# Altium schematic sheet MCU_GPIO.SchDoc
size A4; Organization: Altium Limited; Address1: L3, 12a Rodborough Rd; Address2: Frenchs Forest; Address3: NSW; Address4: Australia 2086; SheetNumber: 6; SheetTotal: 7
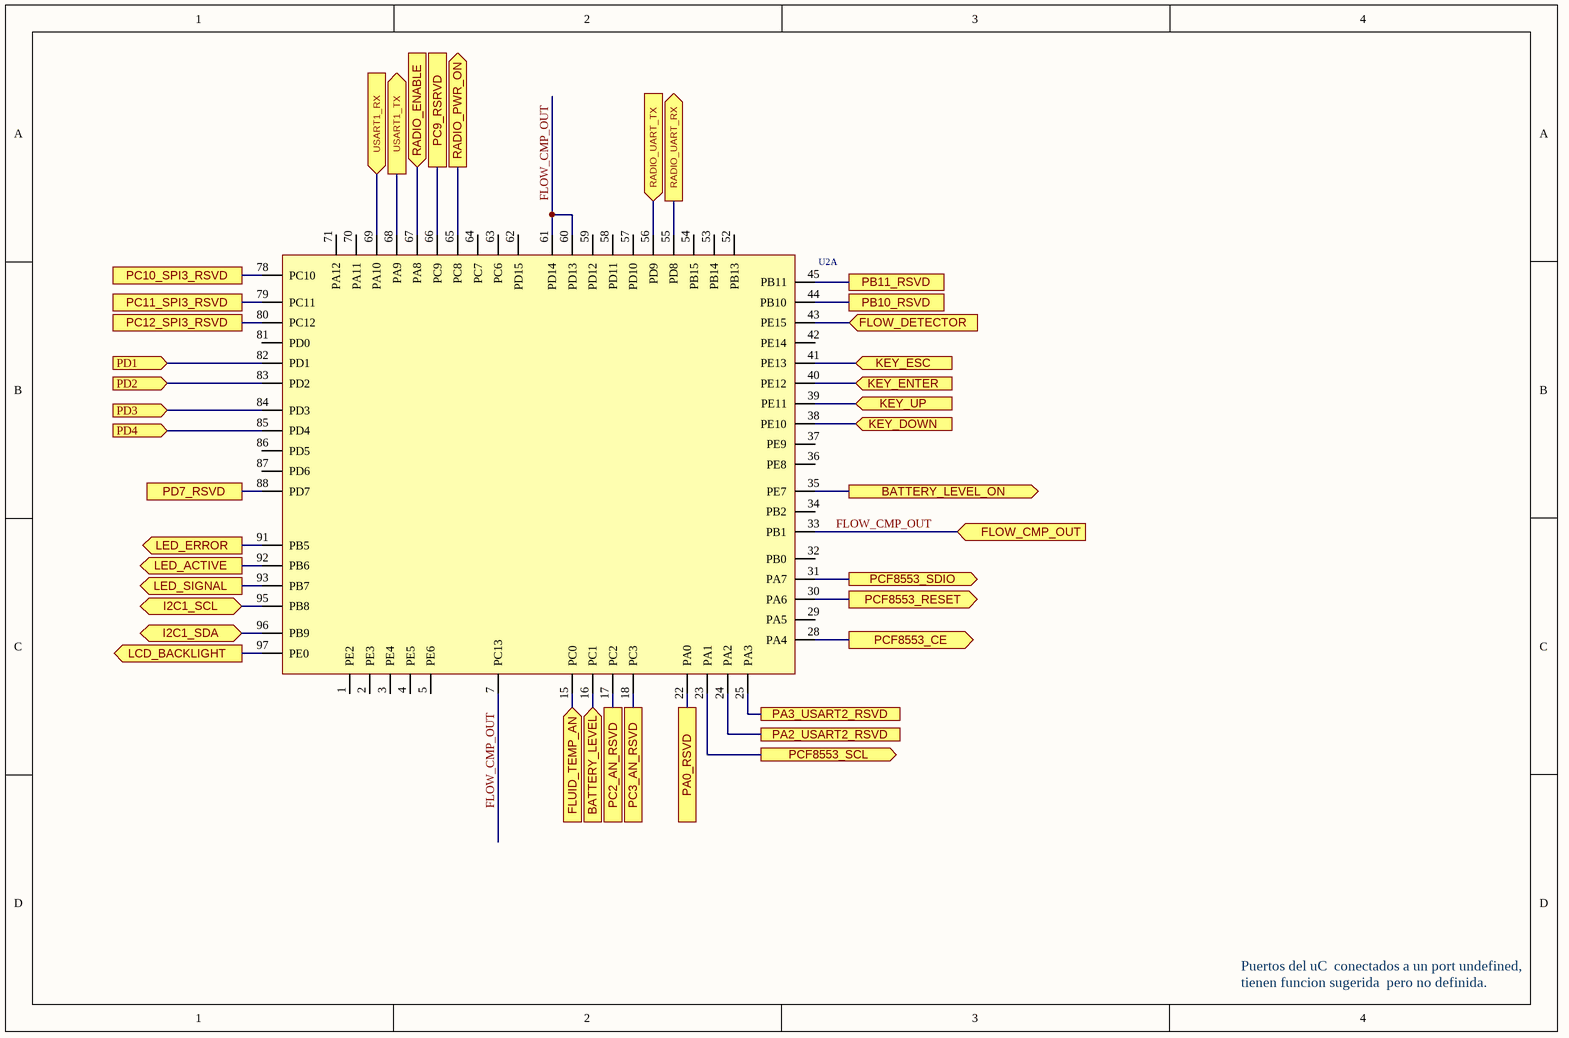
[diagram p0: MCU_GPIO.SchDoc]

## Parts
U2  STM32U575VIT6Q  [STM32U575VI]  (value not drawn)  (part A of 3)

## Ports
BATTERY_LEVEL (in), BATTERY_LEVEL_ON (out), FLOW_CMP_OUT (in), FLOW_DETECTOR (in), FLUID_TEMP_AN (in), I2C1_SCL (bidir), I2C1_SDA (bidir), KEY_DOWN (in), KEY_ENTER (in), KEY_ESC (in), KEY_UP (in), LCD_BACKLIGHT (out), LED_ACTIVE (out), LED_ERROR (out), LED_SIGNAL (out), PA0_RSVD, PA2_USART2_RSVD, PA3_USART2_RSVD, PB10_RSVD, PB11_RSVD, PC2_AN_RSVD, PC3_AN_RSVD, PC9_RSRVD, PC10_SPI3_RSVD, PC11_SPI3_RSVD, PC12_SPI3_RSVD, PCF8553_CE (out), PCF8553_RESET (out), PCF8553_SCL (out), PCF8553_SDIO (out), PD1 (in), PD2 (in), PD3 (in), PD4 (in), PD7_RSVD, RADIO_ENABLE (in), RADIO_PWR_ON (out), RADIO_UART_RX (out), RADIO_UART_TX (in), USART1_RX (in), USART1_TX (out)

## Nets
BATTERY_LEVEL: U2.16(PC1) ; port BATTERY_LEVEL
BATTERY_LEVEL_ON: U2.35(PE7) ; port BATTERY_LEVEL_ON
FLOW_CMP_OUT: U2.7(PC13) U2.33(PB1) U2.60(PD13) U2.61(PD14) ; port FLOW_CMP_OUT
FLOW_DETECTOR: U2.43(PE15) ; port FLOW_DETECTOR
FLUID_TEMP_AN: U2.15(PC0) ; port FLUID_TEMP_AN
I2C1_SCL: U2.95(PB8) ; port I2C1_SCL
I2C1_SDA: U2.96(PB9) ; port I2C1_SDA
KEY_DOWN: U2.38(PE10) ; port KEY_DOWN
KEY_ENTER: U2.40(PE12) ; port KEY_ENTER
KEY_ESC: U2.41(PE13) ; port KEY_ESC
KEY_UP: U2.39(PE11) ; port KEY_UP
LCD_BACKLIGHT: U2.97(PE0) ; port LCD_BACKLIGHT
LED_ACTIVE: U2.92(PB6) ; port LED_ACTIVE
LED_ERROR: U2.91(PB5) ; port LED_ERROR
LED_SIGNAL: U2.93(PB7) ; port LED_SIGNAL
PA0_RSVD: U2.22(PA0) ; port PA0_RSVD
PA2_USART2_RSVD: U2.24(PA2) ; port PA2_USART2_RSVD
PA3_USART2_RSVD: U2.25(PA3) ; port PA3_USART2_RSVD
PB10_RSVD: U2.44(PB10) ; port PB10_RSVD
PB11_RSVD: U2.45(PB11) ; port PB11_RSVD
PC2_AN_RSVD: U2.17(PC2) ; port PC2_AN_RSVD
PC3_AN_RSVD: U2.18(PC3) ; port PC3_AN_RSVD
PC9_RSRVD: U2.66(PC9) ; port PC9_RSRVD
PC10_SPI3_RSVD: U2.78(PC10) ; port PC10_SPI3_RSVD
PC11_SPI3_RSVD: U2.79(PC11) ; port PC11_SPI3_RSVD
PC12_SPI3_RSVD: U2.80(PC12) ; port PC12_SPI3_RSVD
PCF8553_CE: U2.28(PA4) ; port PCF8553_CE
PCF8553_RESET: U2.30(PA6) ; port PCF8553_RESET
PCF8553_SCL: U2.23(PA1) ; port PCF8553_SCL
PCF8553_SDIO: U2.31(PA7) ; port PCF8553_SDIO
PD1: U2.82(PD1) ; port PD1
PD2: U2.83(PD2) ; port PD2
PD3: U2.84(PD3) ; port PD3
PD4: U2.85(PD4) ; port PD4
PD7_RSVD: U2.88(PD7) ; port PD7_RSVD
RADIO_ENABLE: U2.67(PA8) ; port RADIO_ENABLE
RADIO_PWR_ON: U2.65(PC8) ; port RADIO_PWR_ON
RADIO_UART_RX: U2.55(PD8) ; port RADIO_UART_RX
RADIO_UART_TX: U2.56(PD9) ; port RADIO_UART_TX
USART1_RX: U2.69(PA10) ; port USART1_RX
USART1_TX: U2.68(PA9) ; port USART1_TX

Not connected (* = marked no-connect by the designer): U2 1(PE2) 2(PE3) 3(PE4) 4(PE5) 5(PE6) 29(PA5) 32(PB0) 34(PB2) 36(PE8) 37(PE9) 42(PE14) 52(PB13) 53(PB14) 54(PB15) 57(PD10) 58(PD11) 59(PD12) 62(PD15) 63(PC6) 64(PC7) 70(PA11) 71(PA12) 81(PD0) 86(PD5) 87(PD6)

## Notes on the sheet
- Puertos del uC  conectados a un port undefined, tienen funcion sugerida  pero no definida.
- Title:
- Size: A4
- Date:
- FMC-320U MODEL A
- Sheet:
- Time:
- Of:
- Version:
- Revision:
- Release:
- 1
- 0
- FLOWMEET SRL
- File

## Library data of the parts
U2 = STM32U575VIT6Q: Manufacturer: ST; Manufacturer Part Number: STM32U575VIT6Q; Category: Microcontrolador; Datasheet: https://www.st.com/resource/en/datasheet/stm32u575ag.pdf; Temperature Max: 85; Temperature Min: -40